# Altium project stm32-watch.PrjPcb
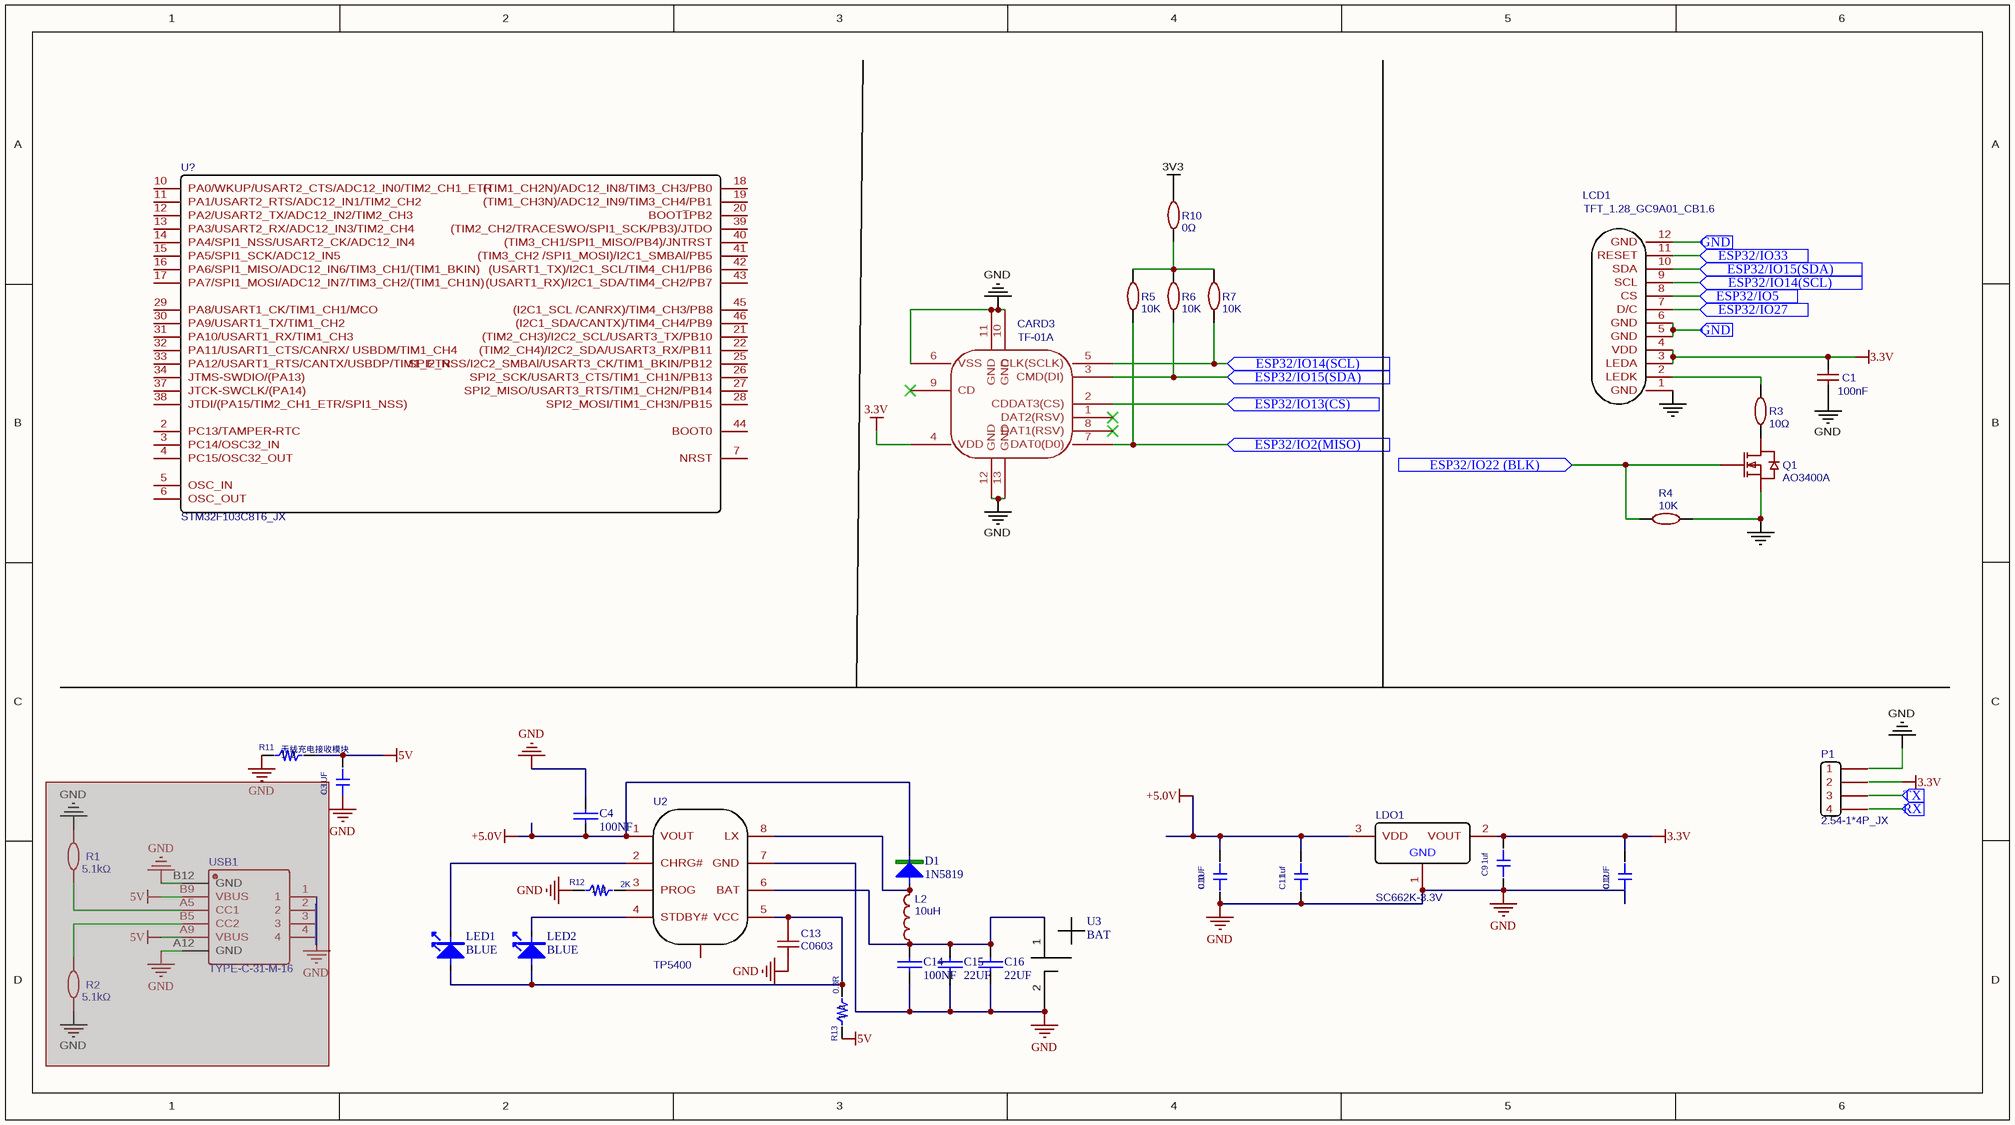
[diagram p0: PCB_esp32_pico d4 video_2022-03-13.schdoc]
1 sheet, 35 parts. Net scope: flat (ports and power ports of the same name join across sheets).
Board file: stm.PcbDoc

## Sheet PCB_esp32_pico d4 video_2022-03-13.schdoc
size 377 x 209 mm

### Parts
C1  100nF  [C0402]
C3  value 0.1UF  [C0402]  (hidden comment: C0402)
C4  100NF  [C0402]
C9  value 1uf  [C0402]  (hidden comment: C0402)
C10  value 0.1UF  [C0402]  (hidden comment: C0402)
C11  value 1uf  [C0402]  (hidden comment: C0402)
C12  value 0.1UF  [C0402]  (hidden comment: C0402)
C13  C0603  [C0402]
C14  100NF  [C0402]
C15  22UF  [C0402]
C16  22UF  [C0402]
CARD3  TF-01A  [TF-SMD_TF-01A]
D1  1N5819  [SOD-323]
L2  10uH  [IND-SMD_L4.0-W4.0]
LCD1  TFT_1.28_GC9A01_CB1.6  [TFT_1.28_GC9A01_CB0.8]
LDO1  SC662K-3.3V  [SOT-23-3_L2.9-W1.3-P1.90-LS2.4-BR]
LED1  BLUE  [LED0603-R-RD]
LED2  BLUE  [LED0603-R-RD]
P1  2.54-1*4P_JX  [2.54-1*4P_TIGHT_JX]
Q1  AO3400A  [SOT-23-3_L2.9-W1.6-P1.90-LS2.8-BR]
R1  5.1kΩ  [R0402]  (masked out: inside a compile mask, not in the netlist)
R2  5.1kΩ  [R0402]  (masked out: inside a compile mask, not in the netlist)
R3  10Ω  [R0402]
R4  10K  [R0402]
R5  10K  [R0402]
R6  10K  [R0402]
R7  10K  [R0402]
R10  0Ω  [R0603]
R11  value 无线充电接收模块  [R_0603]  (hidden comment: R0603)
R12  value 2K  [R_0603]  (hidden comment: R0603)
R13  value 0.3R  [R_0603]  (hidden comment: R0603)
U2  TP5400  [SOIC-8_L5.0-W4.0-P1.27-LS6.0-BL-EP2.0]
U3  BAT  [C0402]
U?  STM32F103C8T6_JX  [LQFP48_JX]
USB1  TYPE-C-31-M-16  [TYPE-C-SMD_TYPE-C-31-M-16]  (masked out: inside a compile mask, not in the netlist)

### Ports
ESP32/IO2(MISO) (in), ESP32/IO5 (in), ESP32/IO13(CS) (in), ESP32/IO14(SCL) (in), ESP32/IO15(SDA) (in), ESP32/IO22 (BLK) (in), ESP32/IO27 (in), ESP32/IO33 (in), GND (in), RX (in), TX (in)

### Nets
3.3V: C1.1 C9.2 C12.2 CARD3.4(VDD) LCD1.3(LEDA) LCD1.4(VDD) LDO1.2(VOUT)
3V3: R10.1
5V: C3.2 R11.2 R13.1
+5.0V: C4.2 C10.2 C11.2 D1.2 LDO1.3(VDD) U2.1(VOUT)
GND: C1.2 C4.1 C9.1 C10.1 C11.1 C12.1 C13.1 C14.2 C15.2 C16.2 CARD3.6(VSS) CARD3.10(GND) CARD3.11(GND) CARD3.12(GND) CARD3.13(GND) LCD1.1(GND) LDO1.1(GND) Q1.2(S) R4.2 R11.1 R12.1 U2.7(GND) U3.2(-)
NetC13_2: C13.2 LED1.1 LED2.1 R13.2 U2.5(VCC)
NetC14_1: C14.1 C15.1 C16.1 L2.1 U2.6(BAT) U3.1(+)
NetCARD3_2: CARD3.2(CDDAT3(CS)) ; port ESP32/IO13(CS)
NetCARD3_3: CARD3.3(CMD(DI)) LCD1.10(SDA) R6.2 ; port ESP32/IO15(SDA)
NetCARD3_5: CARD3.5(CLK(SCLK)) LCD1.9(SCL) R7.2 ; port ESP32/IO14(SCL)
NetCARD3_7: CARD3.7(DAT0(D0)) R5.2 ; port ESP32/IO2(MISO)
NetD1_1: D1.1 L2.2 U2.8(LX)
NetLCD1_2: LCD1.2(LEDK) R3.1
NetLCD1_5: LCD1.5(GND) LCD1.6(GND) LCD1.12(GND) ; port GND
NetLCD1_7: LCD1.7(D/C) ; port ESP32/IO27
NetLCD1_8: LCD1.8(CS) ; port ESP32/IO5
NetLCD1_11: LCD1.11(RESET) ; port ESP32/IO33
NetLED1_2: LED1.2 U2.2(CHRG#)
NetLED2_2: LED2.2 U2.4(STDBY#)
NetQ1_1: Q1.1(G) R4.1 ; port ESP32/IO22 (BLK)
NetQ1_3: Q1.3(D) R3.2
NetR5_1: R5.1 R6.1 R7.1 R10.2
NetR12_2: R12.2 U2.3(PROG)

Not connected (* = marked no-connect by the designer): C3 1; CARD3 1(DAT2(RSV))* 8(DAT1(RSV))* 9(CD)*; P1 1 2 3 4; U2 9; U? 2(PC13/TAMPER-RTC) 3(PC14/OSC32_IN) 4(PC15/OSC32_OUT) 5(OSC_IN) 6(OSC_OUT) 7(NRST) 10(PA0/WKUP/USART2_CTS/ADC12_IN0/TIM2_CH1_ETR) 11(PA1/USART2_RTS/ADC12_IN1/TIM2_CH2) 12(PA2/USART2_TX/ADC12_IN2/TIM2_CH3) 13(PA3/USART2_RX/ADC12_IN3/TIM2_CH4) 14(PA4/SPI1_NSS/USART2_CK/ADC12_IN4) 15(PA5/SPI1_SCK/ADC12_IN5) 16(PA6/SPI1_MISO/ADC12_IN6/TIM3_CH1/(TIM1_BKIN)) 17(PA7/SPI1_MOSI/ADC12_IN7/TIM3_CH2/(TIM1_CH1N)) 18((TIM1_CH2N)/ADC12_IN8/TIM3_CH3/PB0) 19((TIM1_CH3N)/ADC12_IN9/TIM3_CH4/PB1) 20(BOOT~{1}PB2) 21((TIM2_CH3)/I2C2_SCL/USART3_TX/PB10) 22((TIM2_CH4)/I2C2_SDA/USART3_RX/PB11) 25(SPI2_NSS/I2C2_SMBAl/USART3_CK/TIM1_BKIN/PB12) 26(SPI2_SCK/USART3_CTS/TIM1_CH1N/PB13) 27(SPI2_MISO/USART3_RTS/TIM1_CH2N/PB14) 28(SPI2_MOSI/TIM1_CH3N/PB15) 29(PA8/USART1_CK/TIM1_CH1/MCO) 30(PA9/USART1_TX/TIM1_CH2) 31(PA10/USART1_RX/TIM1_CH3) 32(PA11/USART1_CTS/CANRX/_USBDM/TIM1_CH4) 33(PA12/USART1_RTS/CANTX/USBDP/TIM1_ETR) 34(JTMS-SWDIO/(PA13)) 37(JTCK-SWCLK/(PA14)) 38(JTDI/(PA15/TIM2_CH1_ETR/SPI1_NSS)) 39((TIM2_CH2/TRACESWO/SPI1_SCK/PB3)/JTDO) 40((TIM3_CH1/SPI1_MISO/PB4)/JNTRST) 41((TIM3_CH2_/SPI1_MOSI)/I2C1_SMBAl/PB5) 42((USART1_TX)/I2C1_SCL/TIM4_CH1/PB6) 43((USART1_RX)/I2C1_SDA/TIM4_CH2/PB7) 44(BOOT0) 45((I2C1_SCL_/CANRX)/TIM4_CH3/PB8) 46((I2C1_SDA/CANTX)/TIM4_CH4/PB9)

### Notes on the sheet
- Labels drawn without touching a wire or pin: GND

### Library data of the parts
C1 = 100nF: BOM_Manufacturer: YAGEO; BOM_Manufacturer Part: CC0402KRX5R9BB104; nameAlias: Capacitance; BOM_Supplier: LCSC; BOM_Supplier Part: C105882; BOM_JLCPCB Part Class: Extended Part; spicePre: C; spiceSymbolName: CC0402KRX5R9BB104
C3 C9-C12 = C0402: PCB DECAL: CAP_0603_FIRE
C4 C14-C16 = C0805: Capacitor
C13 = C0603: BOM_Manufacturer: Samsung Electro-Mechanics; BOM_Manufacturer Part: 10uF; nameAlias: Value; Contributor: LCSC; BOM_Supplier: LCSC; BOM_Supplier Part: C15415; spicePre: C; spiceSymbolName: 10UF
CARD3 = TF-01A: BOM_Manufacturer: HRO; BOM_Supplier: LCSC; BOM_Manufacturer Part: TF-01A; BOM_Supplier Part: C91145; BOM_JLCPCB Part Class: Extended Part; spicePre: C; spiceSymbolName: TF-01A
D1 = 1N5819: 肖特基二极管
L2 = 10uH: BOM_Manufacturer: Sunlord; BOM_Manufacturer Part: SWPA4030S100MT; nameAlias: Inductance; BOM_Supplier: LCSC; BOM_Supplier Part: C38117; BOM_JLCPCB Part Class: Extended Part; spicePre: L; spiceSymbolName: SWPA4030S100MT
LCD1 = TFT_1.28_GC9A01_CB1.6: Contributor: 启凡科创; spicePre: L; spiceSymbolName: TFT_1.28_GC9A01_CB1.6
LDO1 = SC662K-3.3V: BOM_Manufacturer: FM; BOM_Supplier: LCSC; BOM_Manufacturer Part: SC662K-3.3V; BOM_Supplier Part: C83932; BOM_JLCPCB Part Class: Extended Part; spicePre: L; spiceSymbolName: SC662K-3.3V
LED1 LED2 = LED_B
Q1 = AO3400A: BOM_Manufacturer: AOS; BOM_Supplier: LCSC; BOM_Manufacturer Part: AO3400A; BOM_Supplier Part: C20917; BOM_JLCPCB Part Class: Basic Part; spicePre: Q; spiceSymbolName: AO3400A
R1 R2 = 5.1kΩ: BOM_Manufacturer: Tyohm; BOM_Manufacturer Part: RMC04025.1K5%N; Resistance (Ohms): 5.1K; nameAlias: Resistance; Contributor: LCSC; BOM_Supplier: LCSC; BOM_Supplier Part: C325524; spicePre: R; spiceSymbolName: RMC04025.1K5%N
R3 = 10Ω: BOM_Manufacturer: UniOhm; BOM_Manufacturer Part: 0402WGF100JTCE; nameAlias: Resistance; Resistance (Ohms): 10; BOM_Supplier: LCSC; BOM_Supplier Part: C25077; BOM_JLCPCB Part Class: Basic Part; spicePre: R; spiceSymbolName: 0402WGF100JTCE
R4-R7 = 10K: BOM_Manufacturer: UniOhm; BOM_Manufacturer Part: 0402WGF1002TCE; nameAlias: Resistance (Ohms); BOM_Supplier: LCSC; BOM_Supplier Part: C25744; BOM_JLCPCB Part Class: Basic Part; spicePre: R; spiceSymbolName: 0402WGF1002TCE
R10 = 0Ω: BOM_Manufacturer: UniOhm; BOM_Manufacturer Part: 0603WAJ0000T5E; nameAlias: Resistance; Resistance (Ohms): 0; BOM_Supplier: LCSC; BOM_Supplier Part: C15402; BOM_JLCPCB Part Class: Extended Part; spicePre: R; spiceSymbolName: 0603WAJ0000T5E
U2 = TP5400: 锂电池充放电; BOM_Manufacturer: TOPPOWER; BOM_Supplier: LCSC; BOM_Manufacturer Part: TP5400; BOM_Supplier Part: C24154; BOM_JLCPCB Part Class: Extended Part; spicePre: U; spiceSymbolName: TP5400
U? = STM32F103C8T6_JX: subpart_no: 2; timeStamp: 1455028086; BOM_Supplier Part: C8734; BOM_Supplier: LCSC; spicePre: U; spiceSymbolName: STM32F103C8T6_JX
USB1 = TYPE-C-31-M-16: BOM_Manufacturer: Korean Hroparts Elec; Contributor: LCSC; BOM_Supplier: LCSC; BOM_Supplier Part: C283541; BOM_Manufacturer Part: TYPE-C-31-M-16; BOM_JLCPCB Part Class: Extended Part; spicePre: U; spiceSymbolName: TYPE-C-31-M-16
P1 = 2.54-1*4P_JX: BOM_Supplier Part: C115245; BOM_Supplier: LCSC; spicePre: P; spiceSymbolName: 2.54-1*4P_JX
R11-R13 = R0603: PCB DECAL: R_0603